# Altium schematic sheet MdA_CPU.SchDoc: **
size A4; Author: **; CompanyName: Introducción al Diseño de Circuitos Impresos; Organization: UTN FRBA; Revision: **; SheetNumber: 4; SheetTotal: 4
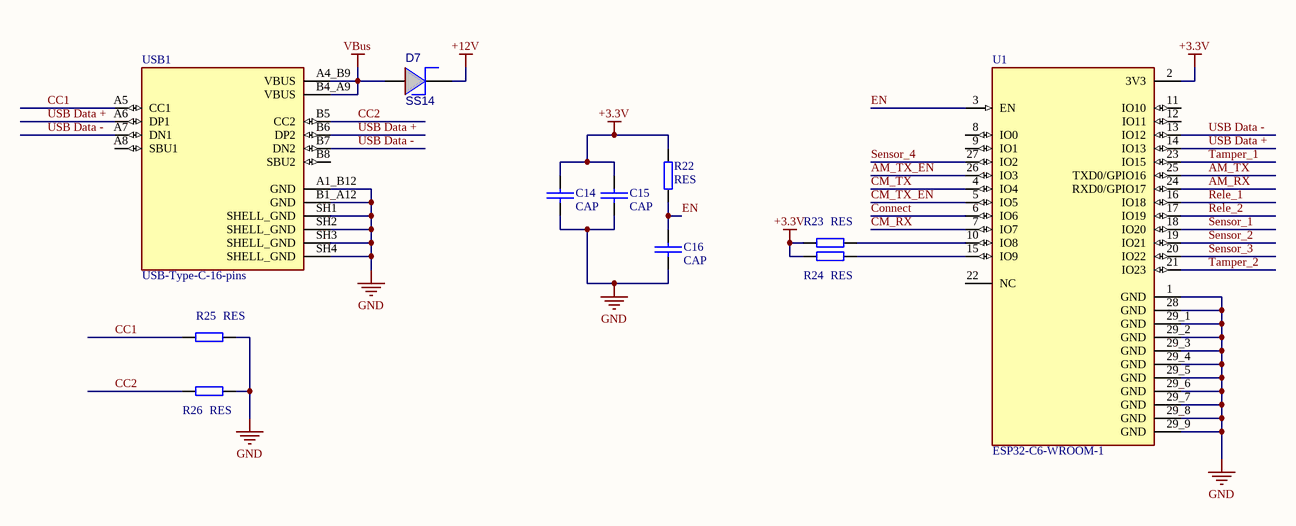
[diagram p0: MdA_CPU.SchDoc]

## Parts
C14  CAP  [C_0402]
C15  CAP  [C_0402]
C16  CAP  [C_0402]
D7  SS14  [D_SMA]
R22  RES  [R_0402]
R23  RES  [R_0402]
R24  RES  [R_0402]
R25  RES  [R_0402]
R26  RES  [R_0402]
U1  ESP32-C6-WROOM-1  [ESP32-C6-WROOM-1]
USB1  USB-Type-C-16-pins  [GCT_USB4105GFA120]

## Nets
+3.3V: C14.1 C15.1 R22.1 R23.2 R24.2 U1.2(3V3)
+12V: D7.2(K)
GND: C14.2 C15.2 C16.2 R25.1 R26.1 U1.1(GND) U1.28(GND) U1.29_1(GND) U1.29_2(GND) U1.29_3(GND) U1.29_4(GND) U1.29_5(GND) U1.29_6(GND) U1.29_7(GND) U1.29_8(GND) U1.29_9(GND) USB1.A1_B12(GND) USB1.B1_A12(GND) USB1.SH1(SHELL_GND) USB1.SH2(SHELL_GND) USB1.SH3(SHELL_GND) USB1.SH4(SHELL_GND)
VBus: D7.1(A) USB1.A4_B9(VBUS) USB1.B4_A9(VBUS)
AM_RX: U1.24(RXD0/GPIO17)
AM_TX: U1.25(TXD0/GPIO16)
AM_TX_EN: U1.26(IO3)
CC1: R25.2 USB1.A5(CC1)
CC2: R26.2 USB1.B5(CC2)
CM_RX: U1.7(IO7)
CM_TX: U1.4(IO4)
CM_TX_EN: U1.5(IO5)
Connect: U1.6(IO6)
EN: C16.1 R22.2 U1.3(EN)
Rele_1: U1.16(IO18)
Rele_2: U1.17(IO19)
Sensor_1: U1.18(IO20)
Sensor_2: U1.19(IO21)
Sensor_3: U1.20(IO22)
Sensor_4: U1.27(IO2)
Tamper_1: U1.23(IO15)
Tamper_2: U1.21(IO23)
USB Data +: U1.14(IO13) USB1.A6(DP1) USB1.B6(DP2)
USB Data -: U1.13(IO12) USB1.A7(DN1) USB1.B7(DN2)
NetR23_1: R23.1 U1.10(IO8)
NetR24_1: R24.1 U1.15(IO9)

Not connected (* = marked no-connect by the designer): U1 8(IO0) 9(IO1) 11(IO10) 12(IO11) 22(NC); USB1 A8(SBU1) B8(SBU2)

## Notes on the sheet
- Title:
- Size:
- Author:
- A4
- Sheet
- of
- Revision:
- File:
- Date:

## Library data of the parts
D7 = DIODO_SH: Diode Shottky